# Altium schematic sheet TOP.SchDoc: CX1000 5V4A
size A4; Date: 2012/02/27; ApprovedBy: 稲村; DrawnBy: 猪鼻; DocumentNumber: Documentnumber; Revision: 1; SheetNumber: 1; SheetTotal: 5; BoardNumber: BoardNumber; PartsNumber: PartsNumber; DrawnDate: 2012/02/27; ApprovedDate: 2012/**/**
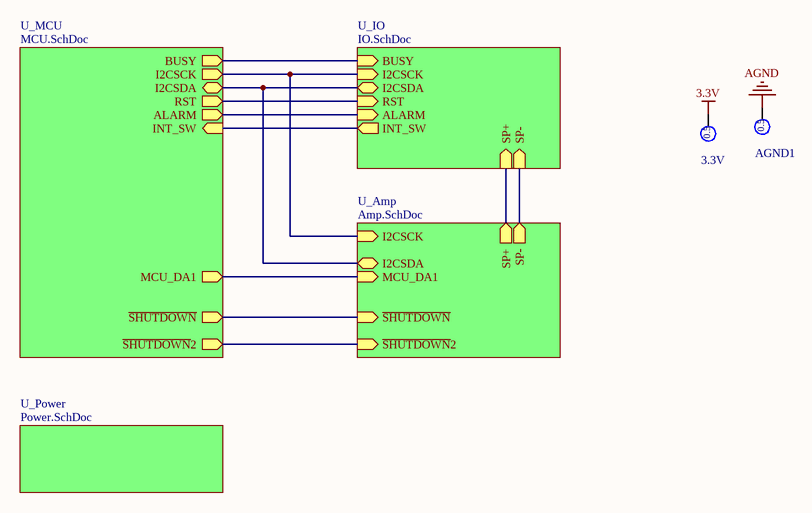
[diagram p0: TOP.SchDoc]

## Parts
3.3V  TP0.5mm  [TP0.5mm]  (value not drawn)  (no BOM)
AGND1  TP0.5mm  [TP0.5mm]  (value not drawn)  (no BOM)

## Sub-sheets
U_Amp = Amp.SchDoc: SP+ (out), SP- (out), MCU_DA1 (in), ~{SHUTDOWN} (in), I2CSCK (in), I2CSDA (bidir), ~{SHUTDOWN}2 (in)
U_IO = IO.SchDoc: SP+ (in), SP- (in), BUSY (in), I2CSCK (in), I2CSDA (bidir), INT_SW (out), RST (in), ALARM (in)
U_MCU = MCU.SchDoc: I2CSCK (out), I2CSDA (bidir), ALARM (out), BUSY (out), MCU_DA1 (out), RST (out), INT_SW (in), ~{SHUTDOWN} (out), ~{SHUTDOWN}2 (out)
U_Power = Power.SchDoc: no entries

## Nets
3.3V: 3.3V.1
AGND: AGND1.1
(unnamed): sheet U_Amp/SP+, sheet U_IO/SP+
(unnamed): sheet U_Amp/SP-, sheet U_IO/SP-
(unnamed): sheet U_Amp/MCU_DA1, sheet U_MCU/MCU_DA1
(unnamed): sheet U_Amp/~{SHUTDOWN}, sheet U_MCU/~{SHUTDOWN}
(unnamed): sheet U_Amp/I2CSCK, sheet U_MCU/I2CSCK, sheet U_IO/I2CSCK
(unnamed): sheet U_Amp/I2CSDA, sheet U_MCU/I2CSDA, sheet U_IO/I2CSDA
(unnamed): sheet U_Amp/~{SHUTDOWN}2, sheet U_MCU/~{SHUTDOWN}2
(unnamed): sheet U_MCU/ALARM, sheet U_IO/ALARM
(unnamed): sheet U_MCU/BUSY, sheet U_IO/BUSY
(unnamed): sheet U_MCU/RST, sheet U_IO/RST
(unnamed): sheet U_MCU/INT_SW, sheet U_IO/INT_SW

## Notes on the sheet
- Project Title:
- Project No:
- Size:
- Date:
- A4
- Rev:
- Page Title:
- Sheet:
- of
- (in symbol TP0.5mm) 0.5

## Library data of the parts
3.3V AGND1 = TP0.5mm: Test-Point 0.5mm